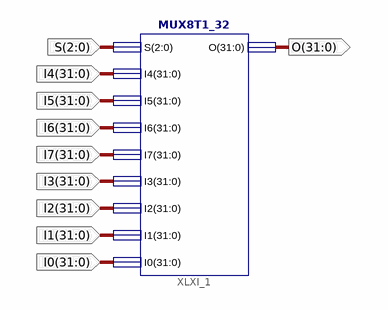
[diagram p0: schematic sheet 1]
// Xilinx ISE schematic MUX1_DispData.sch (kintex7) as structural Verilog: 1 symbols, 10 ports
module MUX1_DispData (
  input  [2:0] S,
  input  [31:0] I4,
  input  [31:0] I5,
  input  [31:0] I6,
  input  [31:0] I7,
  input  [31:0] I3,
  input  [31:0] I2,
  input  [31:0] I1,
  input  [31:0] I0,
  output [31:0] O
);

  MUX8T1_32 XLXI_1 (.S(S), .I4(I4), .I5(I5), .I6(I6), .I7(I7), .I3(I3), .I2(I2), .I1(I1), .I0(I0), .O(O));
endmodule
